# Altium schematic sheet MCU_Sensors_CAN.SchDoc
size B; SheetNumber: 4; SheetTotal: 6
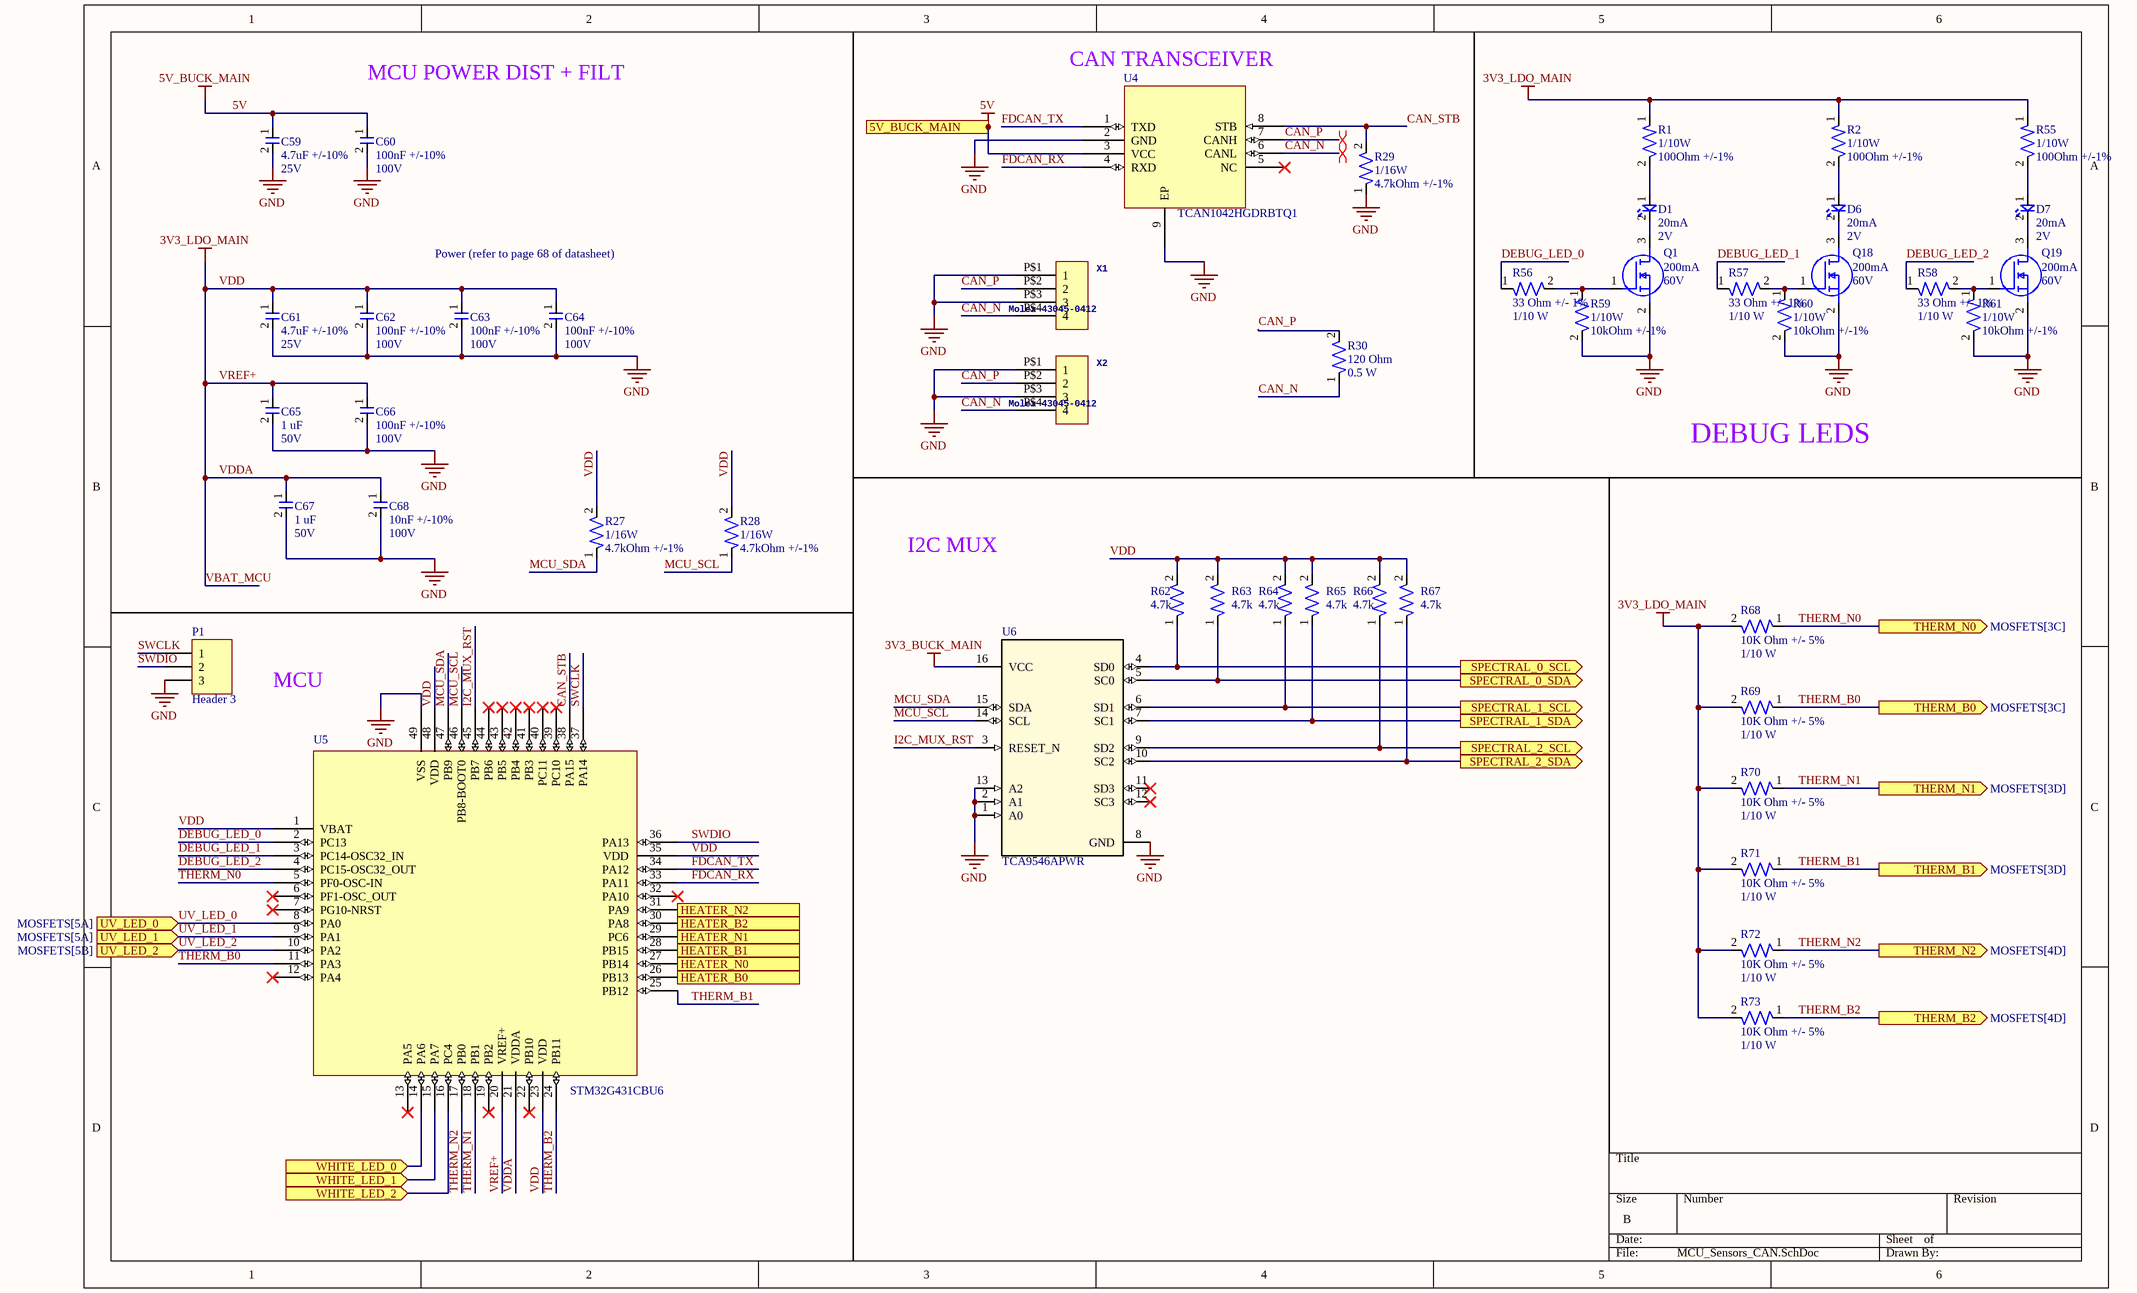
[diagram p0: MCU_Sensors_CAN.SchDoc]

## Parts
C59  Capacitance: 4.7uF +/-10%  Voltage Rating: 25V  [CAP-0603]  (hidden comment: TMK107BBJ475KA-T)
C60  Capacitance: 100nF +/-10%  Voltage Rating: 100V  [CAP-0603]  (hidden comment: CC0603KRX7R0BB104)
C61  Capacitance: 4.7uF +/-10%  Voltage Rating: 25V  [CAP-0603]  (hidden comment: TMK107BBJ475KA-T)
C62  Capacitance: 100nF +/-10%  Voltage Rating: 100V  [CAP-0603]  (hidden comment: CC0603KRX7R0BB104)
C63  Capacitance: 100nF +/-10%  Voltage Rating: 100V  [CAP-0603]  (hidden comment: CC0603KRX7R0BB104)
C64  Capacitance: 100nF +/-10%  Voltage Rating: 100V  [CAP-0603]  (hidden comment: CC0603KRX7R0BB104)
C65  Capacitance: 1 uF  Voltage: 50V  [CAP-0603]  (hidden comment: UMK107AB7105KA-T)
C66  Capacitance: 100nF +/-10%  Voltage Rating: 100V  [CAP-0603]  (hidden comment: CC0603KRX7R0BB104)
C67  Capacitance: 1 uF  Voltage: 50V  [CAP-0603]  (hidden comment: UMK107AB7105KA-T)
C68  Capacitance: 10nF +/-10%  Voltage Rating: 100V  [CAP-0402]  (hidden comment: CC0402KRX7R0BB103)
D1  Current Rating: 20mA  Vf: 2V  [LED-0603]  (hidden comment: 150060AS75000)
D6  Current Rating: 20mA  Vf: 2V  [LED-0603]  (hidden comment: 150060AS75000)
D7  Current Rating: 20mA  Vf: 2V  [LED-0603]  (hidden comment: 150060AS75000)
P1  Header 3  [HDR1X3]
Q1  Id-Continuous: 200mA  VDS-Max: 60V  [NMOS-SOT23-3]  (hidden comment: T2N7002AK,LM)
Q18  Id-Continuous: 200mA  VDS-Max: 60V  [NMOS-SOT23-3]  (hidden comment: T2N7002AK,LM)
Q19  Id-Continuous: 200mA  VDS-Max: 60V  [NMOS-SOT23-3]  (hidden comment: T2N7002AK,LM)
R1  Power Rating: 1/10W  Resistance: 100Ohm +/-1%  [RES-0603]  (hidden comment: AC0603FR-10100RL)
R2  Power Rating: 1/10W  Resistance: 100Ohm +/-1%  [RES-0603]  (hidden comment: AC0603FR-10100RL)
R27  Power Rating: 1/16W  Resistance: 4.7kOhm +/-1%  [RES-0402]  (hidden comment: RC0402FR-074K7P)
R28  Power Rating: 1/16W  Resistance: 4.7kOhm +/-1%  [RES-0402]  (hidden comment: RC0402FR-074K7P)
R29  Power Rating: 1/16W  Resistance: 4.7kOhm +/-1%  [RES-0402]  (hidden comment: RC0402FR-074K7P)
R30  Resistance: 120 Ohm  Power: 0.5 W  [RES-1206]  (hidden comment: CRGH1206F120R)
R55  Power Rating: 1/10W  Resistance: 100Ohm +/-1%  [RES-0603]  (hidden comment: AC0603FR-10100RL)
R56  Resistance: 33 Ohm +/- 1%  Power: 1/10 W  [RES-0402]  (hidden comment: ERJ2RKF33R0X)
R57  Resistance: 33 Ohm +/- 1%  Power: 1/10 W  [RES-0402]  (hidden comment: ERJ2RKF33R0X)
R58  Resistance: 33 Ohm +/- 1%  Power: 1/10 W  [RES-0402]  (hidden comment: ERJ2RKF33R0X)
R59  Power Rating: 1/10W  Resistance: 10kOhm +/-1%  [RES-0603]  (hidden comment: RC0603FR-0710KP)
R60  Power Rating: 1/10W  Resistance: 10kOhm +/-1%  [RES-0603]  (hidden comment: RC0603FR-0710KP)
R61  Power Rating: 1/10W  Resistance: 10kOhm +/-1%  [RES-0603]  (hidden comment: RC0603FR-0710KP)
R62  Resistance: 4.7k  [RES-0402]  (hidden comment: RC0402FR-074K7P)
R63  Resistance: 4.7k  [RES-0402]  (hidden comment: RC0402FR-074K7P)
R64  Resistance: 4.7k  [RES-0402]  (hidden comment: RC0402FR-074K7P)
R65  Resistance: 4.7k  [RES-0402]  (hidden comment: RC0402FR-074K7P)
R66  Resistance: 4.7k  [RES-0402]  (hidden comment: RC0402FR-074K7P)
R67  Resistance: 4.7k  [RES-0402]  (hidden comment: RC0402FR-074K7P)
R68  Resistance: 10K Ohm +/- 5%  Power: 1/10 W  [RES-0402]  (hidden comment: ERJ2GEJ103X)
R69  Resistance: 10K Ohm +/- 5%  Power: 1/10 W  [RES-0402]  (hidden comment: ERJ2GEJ103X)
R70  Resistance: 10K Ohm +/- 5%  Power: 1/10 W  [RES-0402]  (hidden comment: ERJ2GEJ103X)
R71  Resistance: 10K Ohm +/- 5%  Power: 1/10 W  [RES-0402]  (hidden comment: ERJ2GEJ103X)
R72  Resistance: 10K Ohm +/- 5%  Power: 1/10 W  [RES-0402]  (hidden comment: ERJ2GEJ103X)
R73  Resistance: 10K Ohm +/- 5%  Power: 1/10 W  [RES-0402]  (hidden comment: ERJ2GEJ103X)
U4  TCAN1042HGDRBTQ1  [IC-8-VSON]
U5  STM32G431CBU6  [MCU-UFQFPN48]
U6  TCA9546APWR  [PW0016A-IPC_A]
X1  Molex 43045-0412  [43045-0412]
X2  Molex 43045-0412  [43045-0412]

## Ports
5V_BUCK_MAIN, HEATER_B0 (in, see MOSFETS[1B]), HEATER_B1 (in, see MOSFETS[1C]), HEATER_B2 (in, see MOSFETS[1D]), HEATER_N0 (in, see MOSFETS[1A]), HEATER_N1 (in, see MOSFETS[1B]), HEATER_N2 (in, see MOSFETS[1C]), SPECTRAL_0_SCL (out, see MOSFETS[3C]), SPECTRAL_0_SDA (out, see MOSFETS[3C]), SPECTRAL_1_SCL (out, see MOSFETS[3D]), SPECTRAL_1_SDA (out, see MOSFETS[3D]), SPECTRAL_2_SCL (out, see MOSFETS[4D]), SPECTRAL_2_SDA (out, see MOSFETS[4D]), THERM_B0 (out, see MOSFETS[3C]), THERM_B1 (out, see MOSFETS[3D]), THERM_B2 (out, see MOSFETS[4D]), THERM_N0 (out, see MOSFETS[3C]), THERM_N1 (out, see MOSFETS[3D]), THERM_N2 (out, see MOSFETS[4D]), UV_LED_0 (in, see MOSFETS[5A]), UV_LED_1 (in, see MOSFETS[5A]), UV_LED_2 (in, see MOSFETS[5B]), WHITE_LED_0 (in, see MOSFETS[3A]), WHITE_LED_1 (in, see MOSFETS[3B]), WHITE_LED_2 (in, see MOSFETS[3B])

## Nets
3V3_BUCK_MAIN: U6.16(VCC)
5V: C59.1 C60.1 U4.3(VCC) ; port 5V_BUCK_MAIN  [also labelled 5V_BUCK_MAIN]
GND: C59.2 C60.2 C61.2 C62.2 C63.2 C64.2 C65.2 C66.2 C67.2 C68.2 P1.3 Q1.2(S) Q18.2(S) Q19.2(S) R29.1 R59.2 R60.2 R61.2 U4.2(GND) U4.9(EP) U5.49(VSS) U6.1(A0) U6.2(A1) U6.8(GND) U6.13(A2) X1.P$1(1) X1.P$3(3) X2.P$1(1) X2.P$3(3)
VBAT_MCU: C61.1 C62.1 C63.1 C64.1 C65.1 C66.1 C67.1 C68.1 R1.1 R2.1 R27.2 R28.2 R55.1 R62.2 R63.2 R64.2 R65.2 R66.2 R67.2 R68.2 R69.2 R70.2 R71.2 R72.2 R73.2 U5.1(VBAT) U5.20(VREF+) U5.21(VDDA) U5.23(VDD) U5.35(VDD) U5.48(VDD)  [also labelled 3V3_LDO_MAIN, VDD, VDDA, VREF+]
CAN_N: R30.1 U4.6(CANL) X1.P$4(4) X2.P$4(4)
CAN_P: R30.2 U4.7(CANH) X1.P$2(2) X2.P$2(2)
CAN_STB: R29.2 U4.8(STB) U5.38(PA15)
DEBUG_LED_0: R56.1 U5.2(PC13)
DEBUG_LED_1: R57.1 U5.3(PC14-OSC32_IN)
DEBUG_LED_2: R58.1 U5.4(PC15-OSC32_OUT)
FDCAN_RX: U4.4(RXD) U5.33(PA11)
FDCAN_TX: U4.1(TXD) U5.34(PA12)
HEATER_B0: U5.26(PB13) ; port HEATER_B0
HEATER_B1: U5.28(PB15) ; port HEATER_B1
HEATER_B2: U5.30(PA8) ; port HEATER_B2
HEATER_N0: U5.27(PB14) ; port HEATER_N0
HEATER_N1: U5.29(PC6) ; port HEATER_N1
HEATER_N2: U5.31(PA9) ; port HEATER_N2
I2C_MUX_RST: U5.45(PB7) U6.3(RESET_N)
MCU_SCL: R28.1 U5.46(PB8-BOOT0) U6.14(SCL)
MCU_SDA: R27.1 U5.47(PB9) U6.15(SDA)
SPECTRAL_0_SCL: R62.1 U6.4(SD0) ; port SPECTRAL_0_SCL
SPECTRAL_0_SDA: R63.1 U6.5(SC0) ; port SPECTRAL_0_SDA
SPECTRAL_1_SCL: R64.1 U6.6(SD1) ; port SPECTRAL_1_SCL
SPECTRAL_1_SDA: R65.1 U6.7(SC1) ; port SPECTRAL_1_SDA
SPECTRAL_2_SCL: R66.1 U6.9(SD2) ; port SPECTRAL_2_SCL
SPECTRAL_2_SDA: R67.1 U6.10(SC2) ; port SPECTRAL_2_SDA
SWCLK: P1.1 U5.37(PA14)
SWDIO: P1.2 U5.36(PA13)
THERM_B0: R69.1 U5.11(PA3) ; port THERM_B0
THERM_B1: R71.1 U5.25(PB12) ; port THERM_B1
THERM_B2: R73.1 U5.24(PB11) ; port THERM_B2
THERM_N0: R68.1 U5.5(PF0-OSC-IN) ; port THERM_N0
THERM_N1: R70.1 U5.18(PB1) ; port THERM_N1
THERM_N2: R72.1 U5.17(PB0) ; port THERM_N2
UV_LED_0: U5.8(PA0) ; port UV_LED_0
UV_LED_1: U5.9(PA1) ; port UV_LED_1
UV_LED_2: U5.10(PA2) ; port UV_LED_2
WHITE_LED_0: U5.14(PA6) ; port WHITE_LED_0
WHITE_LED_1: U5.15(PA7) ; port WHITE_LED_1
WHITE_LED_2: U5.16(PC4) ; port WHITE_LED_2
NetD1_1: D1.1 R1.2
NetD1_2: D1.2 Q1.3(D)
NetD6_1: D6.1 R2.2
NetD6_2: D6.2 Q18.3(D)
NetD7_1: D7.1 R55.2
NetD7_2: D7.2 Q19.3(D)
NetQ1_1: Q1.1(G) R56.2 R59.1
NetQ18_1: Q18.1(G) R57.2 R60.1
NetQ19_1: Q19.1(G) R58.2 R61.1

Not connected (* = marked no-connect by the designer): U4 5(NC)*; U5 6(PF1-OSC_OUT)* 7(PG10-NRST)* 12(PA4)* 13(PA5)* 19(PB2)* 22(PB10)* 32(PA10)* 39(PC10)* 40(PC11)* 41(PB3)* 42(PB4)* 43(PB5)* 44(PB6)*; U6 11(SD3)* 12(SC3)*

## Layout directives
differential pair: CAN_N, CAN_P

## Notes on the sheet
- (near C60) MCU POWER DIST + FILT
- (near U4) CAN TRANSCEIVER
- Power (refer to page 68 of datasheet)
- DEBUG LEDS
- I2C MUX
- MCU

## Library data of the parts
C59 C61 = CAP-4.7U-0001: 4.7 µF ±10% 25V Ceramic Capacitor X5R 0603 (1608 Metric); Manufacturer: Taiyo Yuden; Assembled?: no; Manufacturer Part Number: TMK107BBJ475KA-T; Temperature Coefficient: X5R; Package Size: 0603
C60 C62-C64 C66 = CAP-100N-0001: CAP CER 0.1UF 100V X7R 0603; Manufacturer: YAGEO; Assembled?: no; Manufacturer Part Number: CC0603KRX7R0BB104; Temperature Coefficient: X7R; Package Size: 0603
C65 C67 = CAP-1U-0002: 1 µF ±10% 50V Ceramic Capacitor X7R 0603 (1608 Metric); Package Size: 0603
C68 = CAP-10N-0001: 10000 pF ±10% 100V Ceramic Capacitor X7R 0402 (1005 Metric); Manufacturer: YAGEO; Assembled?: no; Manufacturer Part Number: CC0402KRX7R0BB103; Temperature Coefficient: X7R; Package Size: 0402
D1 D6 D7 = LED_Amber_0001: CAP CER 0.1UF 100V X7R 0603; Manufacturer: Wurth Electronik; Assembled?: no; Color: Amber; Manufacturer Part Number: 150060AS75000; Package Size: 0603
P1 = Header 3: Header, 3-Pin; LatestRevisionDate: 17-Jul-2002; LatestRevisionNote: Re-released for DXP Platform.; Publisher: Altium Limited
Q1 Q18 Q19 = NMOS-200MA-0001: MOSFET N-CH 60V 200MA SOT23; Manufacturer: Toshiba; FET type: N-Channel; Rds On-Max: 3.9Ohm; Vgs-Max: 20V; Assembled?: no; Manufacturer Part Number: T2N7002AK,LM; Package: SOT-23-3
R1 R2 R55 = RES-100-0002: 100 Ohms ±1% 0.1W, 1/10W Chip Resistor 0603 (1608 Metric) Automotive AEC-Q200 Thick Film; Manufacturer: YAGEO; Assembled?: no; Manufacturer Part Number: AC0603FR-10100RL; Package Size: 0603
R27-R29 R62-R67 = RES-4.7K-0001: RES SMD 4.7K OHM 1% 1/16W 0402; Manufacturer: YAGEO; Assembled?: no; Manufacturer Part Number: RC0402FR-074K7P; Package Size: 0402
  R62-R67: Power Rating: 1/16W
R30 = RES-120-0002: 120 Ohms ±1% 0.5W, 1/2W Chip Resistor 1206 (3216 Metric) Thick Film; Tolerance: 1%; Package Size: 1206
R56-R58 = RES-33-0003-JLC: 100mW Thick Film Resistors ±100ppm/℃ ±1% -55℃~+155℃ 33Ω 0402  Chip Resistor - Surface Mount ROHS; assembled?: yes; JLC part number: C278594
R59-R61 = RES-10K-0002: RES SMD 10K OHM 1% 1/10W 0603; Manufacturer: YAGEO; Assembled?: no; Manufacturer Part Number: RC0603FR-0710KP; Package Size: 0603
R68-R73 = RES-10K-0003-JLC: 100mW Thick Film Resistors 100V ±5% ±200ppm/℃ -55℃~+155℃ 10kΩ 0402  Chip Resistor - Surface Mount ROHS; assembled?: yes; JLC part number: C278577
U4 = IC-CAN-TRANSCEIVER-0002: 1/1 Transceiver CANbus 8-VSON (3x3); Manufacturer: Texas Instrument; CAN Capability: FD-CAN; Manufacturer Part Number: TCAN1042HGDRBTQ1
U5 = IC-STM32G431CBU6: 128KB 1.71V~3.6V ARM-MSeries 32KB 170MHz FLASH 42 UFQFPN-48(7x7) Microcontroller Units (MCUs/MPUs/SOCs) ROHS; Assembled?: no; Manufacturer Part Number: STM32G431CBU6; Package: UFQFPN-48
U6 = IC-MUX-0003: Multiplexer Switch ICs I2C SWITCH 4CH; Mfr_Name: Texas Instruments; Type: DEV; RefDes: RefDes; Copyright: Copyright (C) 2023 Ultra Librarian. All rights reserved.; Manufacturer_Part_Number: TCA9546APWR
X1 X2 = Micro-Fit Molex 4 Pin 2 Row Vertical: GateName_1: G$1; SymbolName_1: HEADER_POS4; DeviceSetName: HEADER_POS4_?; DeviceName: 43045-0412; LibraryName: con-molex-micro-fit-3_0_2; Package: 43045-0412